# EAGLE design CharlieplexedLarsonScannerWandBreakout (EAGLE 6.5.0)
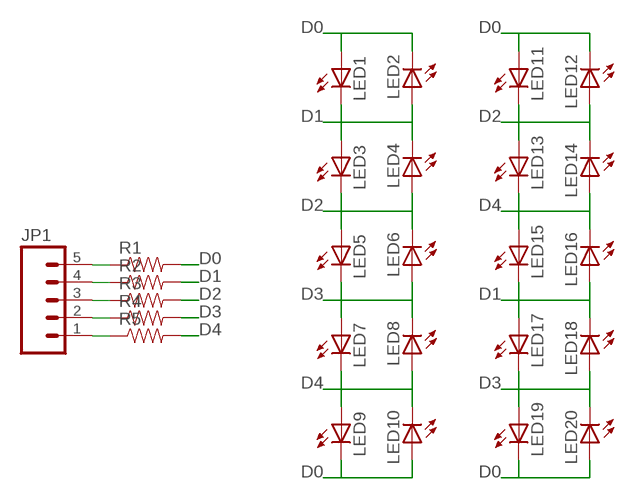
[diagram p0: schematic, sheet 1]

## Parts
JP1  M05PTH  [1X05]
LED1  LEDOVAL  [LED-OVAL]
LED2  LEDOVAL  [LED-OVAL]
LED3  LEDOVAL  [LED-OVAL]
LED4  LEDOVAL  [LED-OVAL]
LED5  LEDOVAL  [LED-OVAL]
LED6  LEDOVAL  [LED-OVAL]
LED7  LEDOVAL  [LED-OVAL]
LED8  LEDOVAL  [LED-OVAL]
LED9  LEDOVAL  [LED-OVAL]
LED10  LEDOVAL  [LED-OVAL]
LED11  LEDOVAL  [LED-OVAL]
LED12  LEDOVAL  [LED-OVAL]
LED13  LEDOVAL  [LED-OVAL]
LED14  LEDOVAL  [LED-OVAL]
LED15  LEDOVAL  [LED-OVAL]
LED16  LEDOVAL  [LED-OVAL]
LED17  LEDOVAL  [LED-OVAL]
LED18  LEDOVAL  [LED-OVAL]
LED19  LEDOVAL  [LED-OVAL]
LED20  LEDOVAL  [LED-OVAL]
R1  RESISTORAXIAL-0.3  [AXIAL-0.3]
R2  RESISTORAXIAL-0.3  [AXIAL-0.3]
R3  RESISTORAXIAL-0.3  [AXIAL-0.3]
R4  RESISTORAXIAL-0.3  [AXIAL-0.3]
R5  RESISTORAXIAL-0.3  [AXIAL-0.3]

## Nets
D0: LED1.ANODE(A) LED2.CATHODE(C) LED9.CATHODE(C) LED10.ANODE(A) LED11.ANODE(A) LED12.CATHODE(C) LED19.CATHODE(C) LED20.ANODE(A) R1.P$2
D1: LED1.CATHODE(C) LED2.ANODE(A) LED3.ANODE(A) LED4.CATHODE(C) LED15.CATHODE(C) LED16.ANODE(A) LED17.ANODE(A) LED18.CATHODE(C) R2.P$2
D2: LED3.CATHODE(C) LED4.ANODE(A) LED5.ANODE(A) LED6.CATHODE(C) LED11.CATHODE(C) LED12.ANODE(A) LED13.ANODE(A) LED14.CATHODE(C) R3.P$2
D3: LED5.CATHODE(C) LED6.ANODE(A) LED7.ANODE(A) LED8.CATHODE(C) LED17.CATHODE(C) LED18.ANODE(A) LED19.ANODE(A) LED20.CATHODE(C) R4.P$2
D4: LED7.CATHODE(C) LED8.ANODE(A) LED9.ANODE(A) LED10.CATHODE(C) LED13.CATHODE(C) LED14.ANODE(A) LED15.ANODE(A) LED16.CATHODE(C) R5.P$2
MISO: JP1.4 R2.P$1
MOSI: JP1.5 R1.P$1
PB3: JP1.2 R4.P$1
PB4: JP1.1 R5.P$1
SCK: JP1.3 R3.P$1

## Library data of the parts
JP1 = SparkFun-Connectors:M05: Header 5 Standard 5-pin 0.1" header. Use with straight break away headers (SKU : PRT-00116), right angle break away headers (PRT-00553), swiss pins (PRT-00743), machine pins (PRT-00117), and female headers (PRT-00115). Molex polarized connector foot print use with SKU : PRT-08230 with associated crimp pins and housings.
LED1-LED20 = barbary_enterprises:LED: LEDs Standard schematic elements and footprints for 5mm, 3mm, 1206, and 0603 sized LEDs. 5mm - Spark Fun Electronics SKU : COM-00529 (and others)
R1-R5 = barbary_enterprises:RESISTOR: Resistor Basic schematic elements and footprints for 0603, 1206, and PTH resistors.

## Board
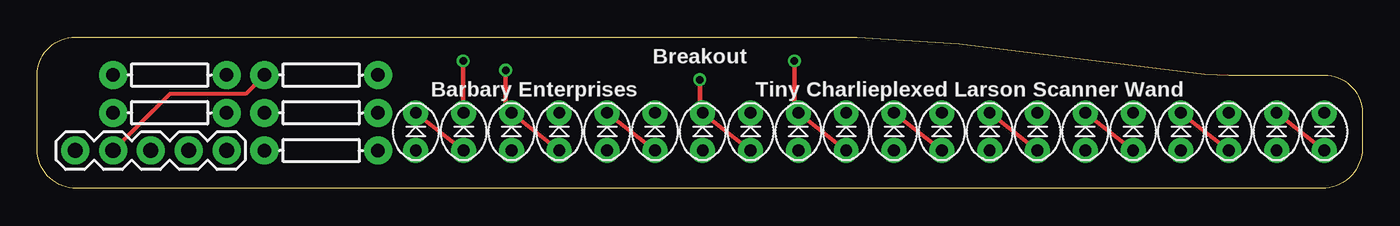
[diagram p1: board, top side]
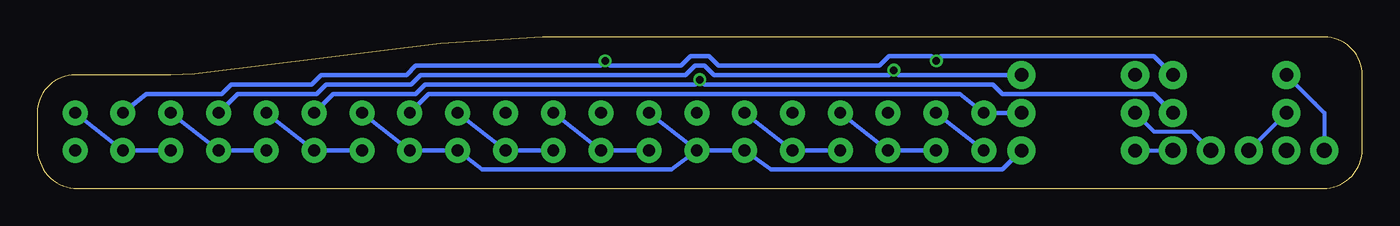
[diagram p2: board, bottom side, seen from below]

Size 88.9 x 10.16 mm. Coordinates in mm from the lower left corner, seen from the top.
Outline: 88.9,5.06 88.9,2.71 arc-90 86.19,0 2.62,0 arc-90 0,2.62 0,7.6 arc-90 2.56,10.16 54.98,10.16 61.83,9.73 77.53,7.77 arc7 79.96,7.62 86.34,7.62 arc-90 88.9,5.06
Copper layers (1*16): Top 0.0356mm / dielectric 1.5011mm / Bottom 0.0356mm
Design rules "LaenPCBOrder": minimum track width 6mil, minimum drill 13mil, track to track 6mil, track to pad 6mil, pad to pad 6mil, via to via 6mil, smd to smd 6mil, copper to edge 15mil, drill to drill 6mil, minimum pad ring 7mil, minimum via ring 7mil, stop-mask expansion 3mil, vias tented up to drill 0mil, thermal gap 10mil

### Footprints (pad centres in the part's own frame; a part is rotated, then mirrored left to right if it is on the bottom)
1X05 = drill 1.016 pad 1.88: 1 0,0; 2 2.54,0; 3 5.08,0; 4 7.62,0; 5 10.16,0
LED-OVAL = drill 0.8 pad 1.676: ANODE 1.27,0; CATHODE -1.27,0
AXIAL-0.3 = drill 0.9 pad 1.88: P$1 -3.81,0; P$2 3.81,0

### Placement (x,y rotation side)
JP1  12.7,2.54 180 top
LED1  86.36,3.81 270 top
LED2  83.15,3.81 270 top
LED3  79.94,3.81 270 top
LED4  76.73,3.81 270 top
LED5  73.53,3.81 270 top
LED6  70.32,3.81 270 top
LED7  67.11,3.81 270 top
LED8  63.9,3.81 270 top
LED9  60.69,3.81 270 top
LED10  57.48,3.81 270 top
LED11  54.28,3.81 270 top
LED12  51.07,3.81 270 top
LED13  47.86,3.81 270 top
LED14  44.65,3.81 270 top
LED15  41.44,3.81 270 top
LED16  38.23,3.81 270 top
LED17  35.03,3.81 270 top
LED18  31.82,3.81 270 top
LED19  28.61,3.81 270 top
LED20  25.4,3.81 270 top
R1  8.89,7.62 0 top
R2  19.05,7.62 0 top
R3  8.89,5.08 0 top
R4  19.05,5.08 0 top
R5  19.05,2.54 0 top

### Tracks (layer width: path | path; a pad name or v marks a point on that pad's centre or on a via)
D0  (via drill 0.51)
  Top 0.305: LED1.ANODE LED2.CATHODE | LED11.ANODE LED12.CATHODE 50.8,5.35 v50.8,8.57 | v28.57,8.57 28.57,5.08 LED19.CATHODE
  Bottom 0.305: LED11.ANODE LED10.ANODE LED9.CATHODE | LED19.CATHODE LED20.ANODE | LED2.CATHODE 81.6,6.35 76.52,6.35 75.88,6.99 70.48,6.99 69.85,7.62 64.14,7.62 63.5,8.26 51.12,8.26 v50.8,8.57 50.48,8.26 45.72,8.26 45.09,8.89 43.81,8.89 43.18,8.26 32.38,8.26 31.75,8.89 28.89,8.89 v28.57,8.57 28.26,8.89 13.97,8.89 R1.P$2
D1  (via drill 0.51)
  Top 0.305: LED3.ANODE LED4.CATHODE | LED17.ANODE LED18.CATHODE 31.43,5.46 v31.43,7.94
  Bottom 0.305: LED3.ANODE LED2.ANODE LED1.CATHODE | LED17.ANODE LED16.ANODE LED15.CATHODE | LED4.CATHODE 75.47,6.35 70.17,6.35 69.53,6.99 63.82,6.99 63.18,7.62 45.4,7.62 44.77,8.26 44.13,8.26 43.5,7.62 31.75,7.62 v31.43,7.94 31.11,7.62 R2.P$2
D2  (via drill 0.51)
  Top 0.305: LED5.ANODE LED6.CATHODE | LED13.ANODE LED14.CATHODE 44.45,5.28 v44.45,7.3
  Bottom 0.305: LED5.ANODE LED4.ANODE LED3.CATHODE | LED13.ANODE LED12.ANODE LED11.CATHODE | LED6.CATHODE 69.05,6.35 63.5,6.35 62.87,6.99 44.77,6.99 v44.45,7.3 44.13,6.99 24.77,6.99 24.13,6.35 13.97,6.35 R3.P$2
D3
  Top 0.305: LED7.ANODE LED8.CATHODE | LED19.ANODE LED20.CATHODE
  Bottom 0.305: LED19.ANODE LED18.ANODE LED17.CATHODE | LED5.CATHODE LED6.ANODE LED7.ANODE | LED8.CATHODE 62.63,6.35 26.99,6.35 LED20.CATHODE R4.P$2
D4
  Top 0.305: LED15.ANODE LED16.CATHODE | LED10.CATHODE LED9.ANODE
  Bottom 0.305: LED14.ANODE LED15.ANODE 39.69,1.27 24.13,1.27 R5.P$2 | LED7.CATHODE LED8.ANODE LED9.ANODE 59.05,1.27 46.35,1.27 LED14.ANODE | LED13.CATHODE LED14.ANODE
MISO
  Top 0.254: R2.P$1 13.97,6.35 8.89,6.35 JP1.4
MOSI
  Bottom 0.254: R1.P$1 3.17,5.71 2.54,5.08 JP1.5
PB3
  Bottom 0.254: R4.P$1 13.97,3.81 11.43,3.81 JP1.2
PB4
  Bottom 0.254: R5.P$1 JP1.1
SCK
  Bottom 0.254: R3.P$1 JP1.3

### Text on the board
tPlace: Breakout | Barbary Enterprises | Tiny Charlieplexed Larson Scanner Wand